# Altium schematic sheet STeaMi-FP1-Batterie.SchDoc
size A3; DocumentNumber: 1; SheetNumber: 2; SheetTotal: 16
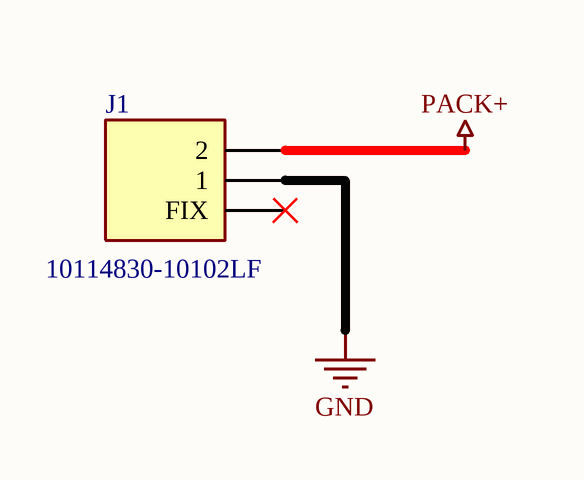
[diagram p0: STeaMi-FP1-Batterie.SchDoc]

## Parts
J1  Manufacturer Part Number: 10114830-10102LF  [1011483010102LF]

## Nets
GND: J1.1
PACK+: J1.2

Not connected (* = marked no-connect by the designer): J1 FIX*

## Notes on the sheet
- Le présent document est la propriété exclusive de SmartEmbed. Remis à titre confidentiel, il ne peut être communiqué
- IND
- DATE
- DESCRIPTION
- VISA
- à des tiers, ni utilisé ou reproduit qu'en stricte conformité d'autorisations expresses préalables.
- Etabli le:
- Verifié le:
- Validé le:
- Par:
- Page:
- /
- Pépinière CleanTech Domaine du Petit Arbois Avenue Louis Philibert BP 80058 13792 AIX-EN-PROVENCE CEDEX 3
- REFERENCE
- DESIGNATION

## Library data of the parts
J1 = 1011483010102LF: CONN header smd 2 positions 1,25 mm; Manufacturer: Amphenol; Populated: False; Switch possibility: False; Vérification: Non; Checked by: *; Creation Date: 26/08/2021; Created by: EAG; Part Number: 1011483010102LF; Mouser: 609-5378-1-ND